# EAGLE design untitled (EAGLE 9.6.2)
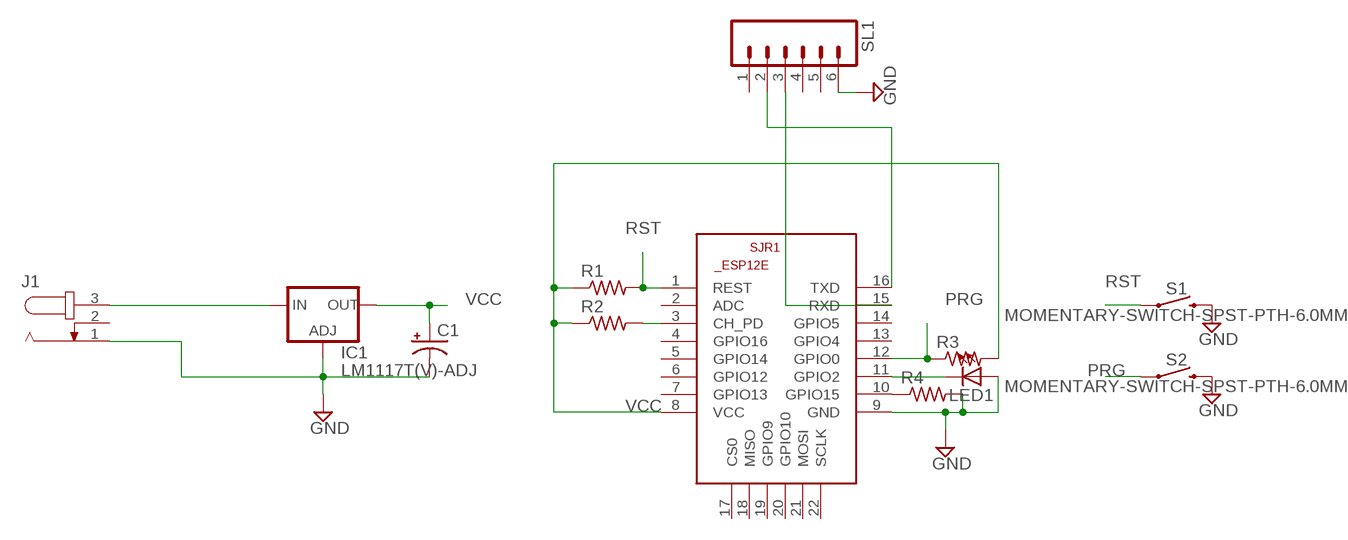
[diagram p0: schematic, sheet 1]

## Parts
C1  CAPACITOR-PE5-10.5  [E5-10,5]
IC1  LM1117T(V)-ADJ  [TO220V]
J1  JACK-PLUG1  [SPC4078]
LED1  LED5MM  [LED5MM]
R1  R-US_0207/10  [0207/10]
R2  R-US_0207/10  [0207/10]
R3  R-US_0207/10  [0207/10]
R4  R-US_0207/10  [0207/10]
S1  MOMENTARY-SWITCH-SPST-PTH-6.0MM  [TACTILE_SWITCH_PTH_6.0MM]
S2  MOMENTARY-SWITCH-SPST-PTH-6.0MM  [TACTILE_SWITCH_PTH_6.0MM]
SJR1  ESP8266-12EESP12E  [ESP8266-ESP12E]
SL1  M06  [06P]

## Nets
GND: C1.- IC1.1(ADJ) J1.1 LED1.A R4.2 S1.3 S2.3 SJR1.9(GND) SL1.6
N$1: IC1.3(IN) J1.3
N$2: R2.2 SJR1.3(CH_PD)
N$3: SJR1.16(TXD) SL1.2
N$4: SJR1.15(RXD) SL1.3
N$5: LED1.K(C) SJR1.11(GPIO2)
N$6: R4.1 SJR1.10(GPIO15)
PRG: R3.1 S2.1 SJR1.12(GPIO0)
RST: R1.2 S1.1 SJR1.1(REST)
VCC: C1.+ IC1.2(OUT) R1.1 R2.1 R3.2 SJR1.8(VCC)
Unconnected: J1.2 SJR1.2(ADC) SJR1.4(GPIO16) SJR1.5(GPIO14) SJR1.6(GPIO12) SJR1.7(GPIO13) SJR1.13(GPIO4) SJR1.14(GPIO5) SJR1.17(CS0) SJR1.18(MISO) SJR1.19(GPIO9) SJR1.20(GPIO10) SJR1.21(MOSI) SJR1.22(SCLK) SL1.1 SL1.4 SL1.5

## Library data of the parts
C1 = BeagleBone_Blue_R3:CAPACITOR-P: POLARIZED CAPACITOR, American symbol
IC1 = lm1117_10:LM1117?-ADJ: 800mA Low-Dropout Linear Regulator Source: http://www.ti.com/lit/ds/symlink/lm1117-n.pdf; MF: Texas Instruments; MPN: LM1777T-ADJ; OC_FARNELL: 9485805; OC_NEWARK: 13B5345
J1 = con-jack:JACK-PLUG: DC POWER JACK Power Jack, DC, Right Angle, Through Hole, Rated 5A at 16VDC, PC Terminals Distributor: Farnell (www.Farnell.de) Drawing: 84N1161.pdf / 84N1162.pdf Manufacturer: SPC Technology (www.spctechnology.com) Type: SPC4077 / SPC 4078; OC_FARNELL: unknown; OC_NEWARK: unknown
LED1 = adafruit:LED: LED OSRAM: - CHIPLED LG R971, LG N971, LY N971, LG Q971, LY Q971, LO R971, LY R971 LH N974, LH R974 LS Q976, LO Q976, LY Q976 LO Q996 - Hyper CHIPLED LW Q18S LB Q993, LB Q99A, LB R99A - SideLED LS A670, LO A670, LY A670, LG A670, LP A670 LB A673, LV A673, LT A673, LW A673 LH A674 LY A675 LS A676, LA A676, LO A676, LY A676, LW A676 LS A679, LY A679, LG A679 - Hyper Micro SIDELED® LS Y876, LA Y876, LO Y876, LY Y876 LT Y87S - SmartLED LW L88C, LW L88S LB L89C, LB L89S, LG L890 LS L89K, LO L89K, LY L89K LS L896, LA L896, LO L896, LY L896 - TOPLED LS T670, LO T670, LY T670, LG T670, LP T670 LSG T670, LSP T670, LSY T670, LOP T670, LYG T670 LG T671, LOG T671, LSG T671 LB T673, LV T673, LT T673, LW T673 LH T674 LS T676, LA T676, LO T676, LY T676, LB T676, LH T676, LSB T676, LW T676 LB T67C, LV T67C, LT T67C, LS T67K, LO T67K, LY T67K, LW E67C LS E67B, LA E67B, LO E67B, LY E67B, LB E67C, LV E67C, LT E67C LW T67C LS T679, LY T679, LG T679 LS T770, LO T770, LY T770, LG T770, LP T770 LB T773, LV T773, LT T773, LW T773 LH T774 LS E675, LA E675, LY E675, LS T675 LS T776, LA T776, LO T776, LY T776, LB T776 LHGB T686 LT T68C, LB T68C - Hyper Mini TOPLED® LB M676 - Mini TOPLED Santana® LG M470 LS M47K, LO M47K, LY M47K Source: http://www.osram.convergy.de/
R1-R4 = adafruit:R-US_: RESISTOR, American symbol
S1 S2 = SparkFun-Switches:MOMENTARY-SWITCH-SPST: Momentary Switch (Pushbutton) - SPST Normally-open (NO) SPST momentary switches (buttons, pushbuttons). Variants PTH-12MM - 12mm square, through-hole Momentary Pushbutton Switch - 12mm Square <https://www.sparkfun.com/products/9190> (COM-09190) PTH-6.0MM, PTH-6.0MM-KIT - 6.0mm square, through-hole Mini Pushbutton Switch <https://www.sparkfun.com/products/97> (COM-00097) KIT package intended for soldering kit's - only one side of pads' copper is exposed. PTH-RIGHT-ANGLE-KIT - Right-angle, through-hole Right Angle Tactile Button <https://www.sparkfun.com/products/10791> - Used on SparkFun BigTime Watch Kit <https://www.sparkfun.com/products/11734> SMD-12MM - 12mm square, surface-mount Tactile Button - SMD (12mm) <https://www.sparkfun.com/products/12993> (COM-12993) Used on SparkFun PicoBoard <https://www.sparkfun.com/products/11888> SMD-4.5MM - 4.5mm Square Trackball Switch Used on SparkFun Blackberry Trackballer Breakout <https://www.sparkfun.com/products/13169> SMD-4.6MMX2.8MM - 4.60mm x 2.80mm, surface mount Used on SparkFun SAMD21 Mini Breakout <https://www.sparkfun.com/products/13664> SMD-5.2MM, SMD-5.2-REDUNDANT - 5.2mm square, surface-mount Mini Pushbutton Switch - SMD <https://www.sparkfun.com/products/8720> (COM-08720) Used on Arduino Pro Mini <https://www.sparkfun.com/products/11114> REDUNDANT package connects both switch circuits together SMD-6.0X3.5MM - 6.0 x 3.5mm, surface mount Momentary Reset Switch SMD <https://www.sparkfun.com/products/8229> (COM-08229) SMD-6.2MM-TALL - 6.2mm square, surface mount Tactile Button - SMD (6mm) <https://www.sparkfun.com/products/12992> Used on SparkFun Digital Sandbox <https://www.sparkfun.com/products/12651> SMD-RIGHT-ANGLE - Right-angle, surface mount Used on SparkFun Block for Intel® Edison - Arduino <https://www.sparkfun.com/products/13036>; PROD_ID: SWCH-08441; SF_SKU: COM-00097
SJR1 = esp12e:ESP8266-12E: ESP8266-12E Library for Eagle CAD The author not responsible for any damages or errors!. Created by Suhail jr.lt;/author>
SL1 = con-amp-quick:M06: AMP QUICK CONNECTOR; OC_FARNELL: unknown; OC_NEWARK: unknown

## Board
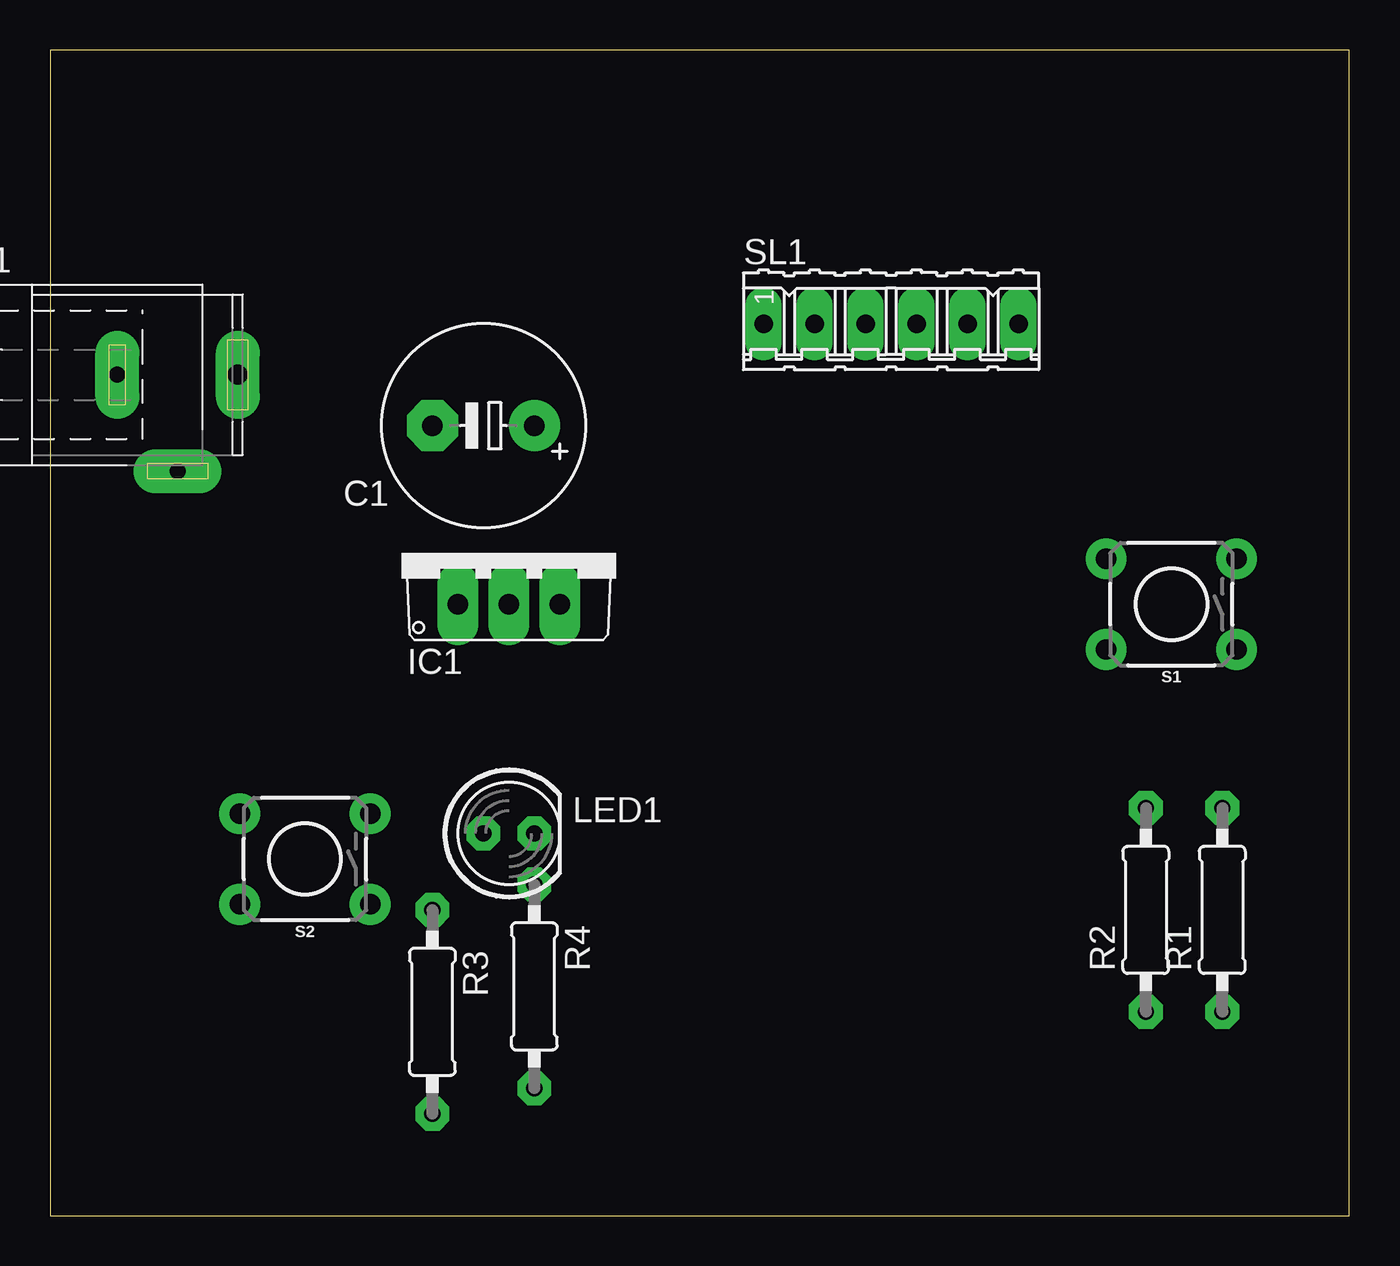
[diagram p1: board, top side]
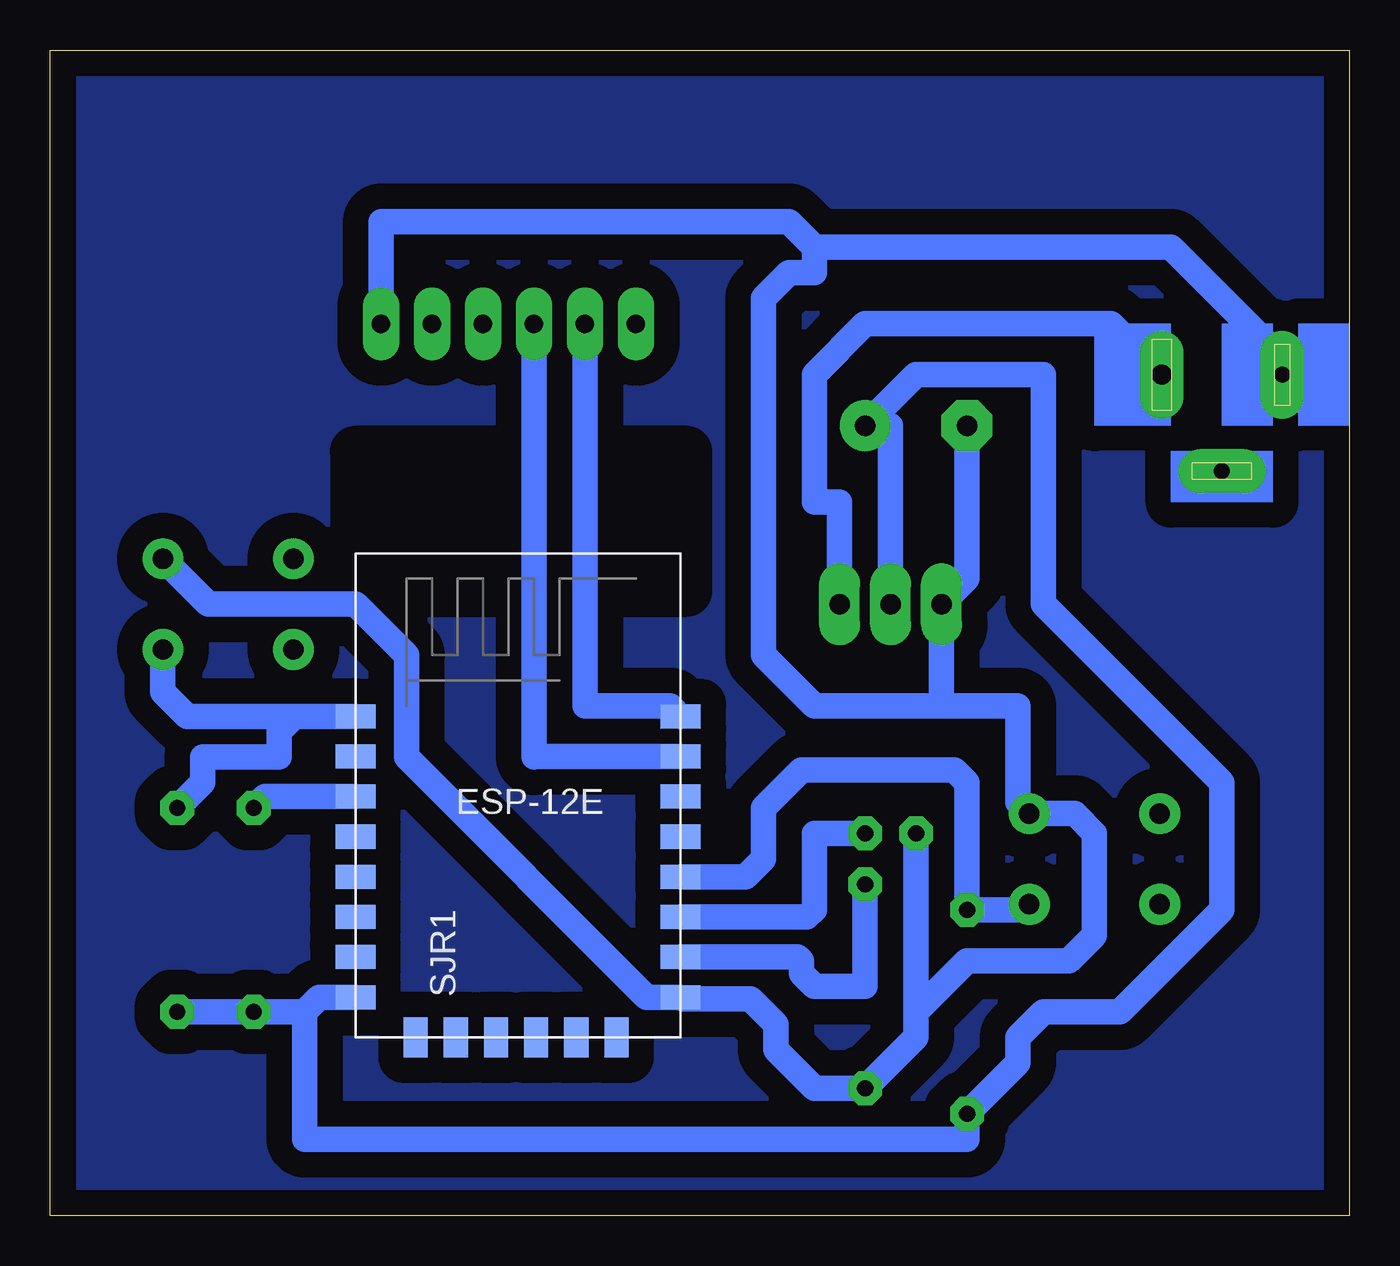
[diagram p2: board, bottom side, seen from below]

Size 64.75 x 58.09 mm. Coordinates in mm from the lower left corner, seen from the top.
Outline: 0,0 64.75,0 64.75,58.09 0,58.09 0,0
Copper layers (1*16): Top 0.035mm / dielectric 1.5mm / Bottom 0.035mm
Design rules "default *": minimum track width 6mil, minimum drill 0.35mm, track to track 6mil, track to pad 6mil, pad to pad 6mil, via to via 6mil, smd to smd 6mil, copper to edge 40mil, drill to drill 6mil, minimum pad ring 10mil, minimum via ring 8mil, stop-mask expansion 4mil, vias tented up to drill 0mil, thermal gap 10mil

### Footprints (pad centres in the part's own frame; a part is rotated, then mirrored left to right if it is on the bottom)
E5-10,5 = drill 1.016 pad 2.54: + -2.54,0 | drill 1.016 pad 2.54 octagon: - 2.54,0
TO220V = drill 1.016 long: 1 -2.54,-2.54; 2 0,-2.54; 3 2.54,-2.54
SPC4078 = drill 0.8 pad 2.184 long: 1 -3,0; 2 0,-4.8 | drill 1 pad 2.184 long: 3 3,0
LED5MM = drill 0.813 pad 1.676 octagon: A -1.27,0; K 1.27,0
0207/10 = drill 0.813 pad 1.676 octagon: 1 -5.08,0; 2 5.08,0
TACTILE_SWITCH_PTH_6.0MM = drill 1.016 pad 1.88: 1 -3.251,2.261; 2 3.251,2.261; 3 -3.251,-2.261; 4 3.251,-2.261
ESP8266-ESP12E = smd 2 x 1.2: 1 -7.62,5.84; 2 -7.62,3.84; 3 -7.62,1.84; 4 -7.62,-0.16; 5 -7.62,-2.16; 6 -7.62,-4.16; 7 -7.62,-6.16; 8 -7.62,-8.16; 9 8.58,-8.16; 10 8.58,-6.16; 11 8.58,-4.16; 12 8.58,-2.16; 13 8.58,-0.16; 14 8.58,1.84; 15 8.58,3.84; 16 8.58,5.84 | smd 1.2 x 2: 17 -4.62,-10.16; 18 -2.62,-10.16; 19 -0.62,-10.16; 20 1.38,-10.16; 21 3.38,-10.16; 22 5.38,-10.16
06P = drill 0.914 long: 1 -6.35,0; 2 -3.81,0; 3 -1.27,0; 4 1.27,0; 5 3.81,0; 6 6.35,0

### Placement (x,y rotation side)
C1  21.59,39.37 180 top
IC1  22.86,33.02 0 top
J1  6.35,41.91 0 top
LED1  22.86,19.05 0 top
R1  58.42,15.24 90 top
R2  54.61,15.24 90 top
R3  19.05,10.16 270 top
R4  24.13,11.43 270 top
S1  55.88,30.48 180 top
S2  12.7,17.78 180 top
SJR1  41.91,19.05 0 bottom
SL1  41.91,44.45 0 top

### Tracks (layer width: path | path; a pad name or v marks a point on that pad's centre or on a via)
GND
  Bottom 1.27: S1.3 56.87,30.48 49.53,30.48 46.99,27.94 46.99,22.86 35.02,10.89 SJR1.9 33.23,10.8 29.84,10.8 28.57,9.52 28.57,8.26 26.67,6.35 R4.2 21.59,8.89 21.59,10.16 | 21.59,10.16 19.05,12.7 13.97,12.7 12.7,13.97 12.7,19.05 13.69,20.04 S2.3 16.51,20.6 16.51,25.4 20.32,25.4 | C1.- 19.05,31.75 IC1.1 20.32,25.4 | 20.32,25.4 26.67,25.4 29.21,27.94 29.21,45.72 27.94,46.99 26.67,46.99 26.67,48.26 | SL1.6 48.26,49.53 27.94,49.53 26.67,48.26 | 26.67,48.26 8.89,48.26 3.81,43.18 3.81,40.64 2.54,40.64 2.54,41.1 J1.1 | LED1.A 21.59,10.16
N$1
  Bottom 1.27: IC1.3 25.4,35.56 26.67,35.56 26.67,41.91 24.13,44.45 11.89,44.45 J1.3
N$2
  Bottom 1.27: SJR1.3 54.04,20.89 R2.2
N$3
  Bottom 1.27: SJR1.16 33.84,25.4 38.1,25.4 SL1.2
N$4
  Bottom 1.27: SJR1.15 40.61,22.89 40.64,22.86 SL1.3
N$5
  Bottom 1.27: LED1.K 26.67,19.05 26.67,15.24 27.02,14.89 SJR1.11
N$6
  Bottom 1.27: R4.1 24.13,11.43 26.67,11.43 27.3,12.06 27.3,12.7 27.5,12.89 SJR1.10
N$7
  pour Bottom (isolate 1.27): 0,58.42 64.14,58.42 64.14,0.63 0,0.63
PRG
  Bottom 1.27: S2.1 16.23,15.24 R3.1 19.05,21.59 19.68,22.23 27.3,22.23 29.21,20.32 29.21,17.78 30.1,16.89 SJR1.12
RST
  Bottom 1.27: R1.2 57.15,21.59 57.15,22.86 53.34,22.86 53.34,24.13 52.58,24.89 | SJR1.1 50.8,24.89 52.58,24.89 | 52.58,24.89 57.91,24.89 59.13,26.11 S1.1
VCC
  Bottom 1.27: 52.07,10.16 52.07,3.81 19.05,3.81 R3.2 16.51,7.62 16.51,8.89 15.24,10.16 11.43,10.16 6.35,15.24 6.35,21.59 15.24,30.48 15.24,41.91 21.59,41.91 C1.+ 22.86,39.37 IC1.2 | 52.07,10.16 51.34,10.89 SJR1.8 | 52.07,10.16 R2.1 R1.1
(copper drawn outside any net)
  shapes: Bottom area x4